# EAGLE design lpc1343-dip40 (EAGLE 5.09)
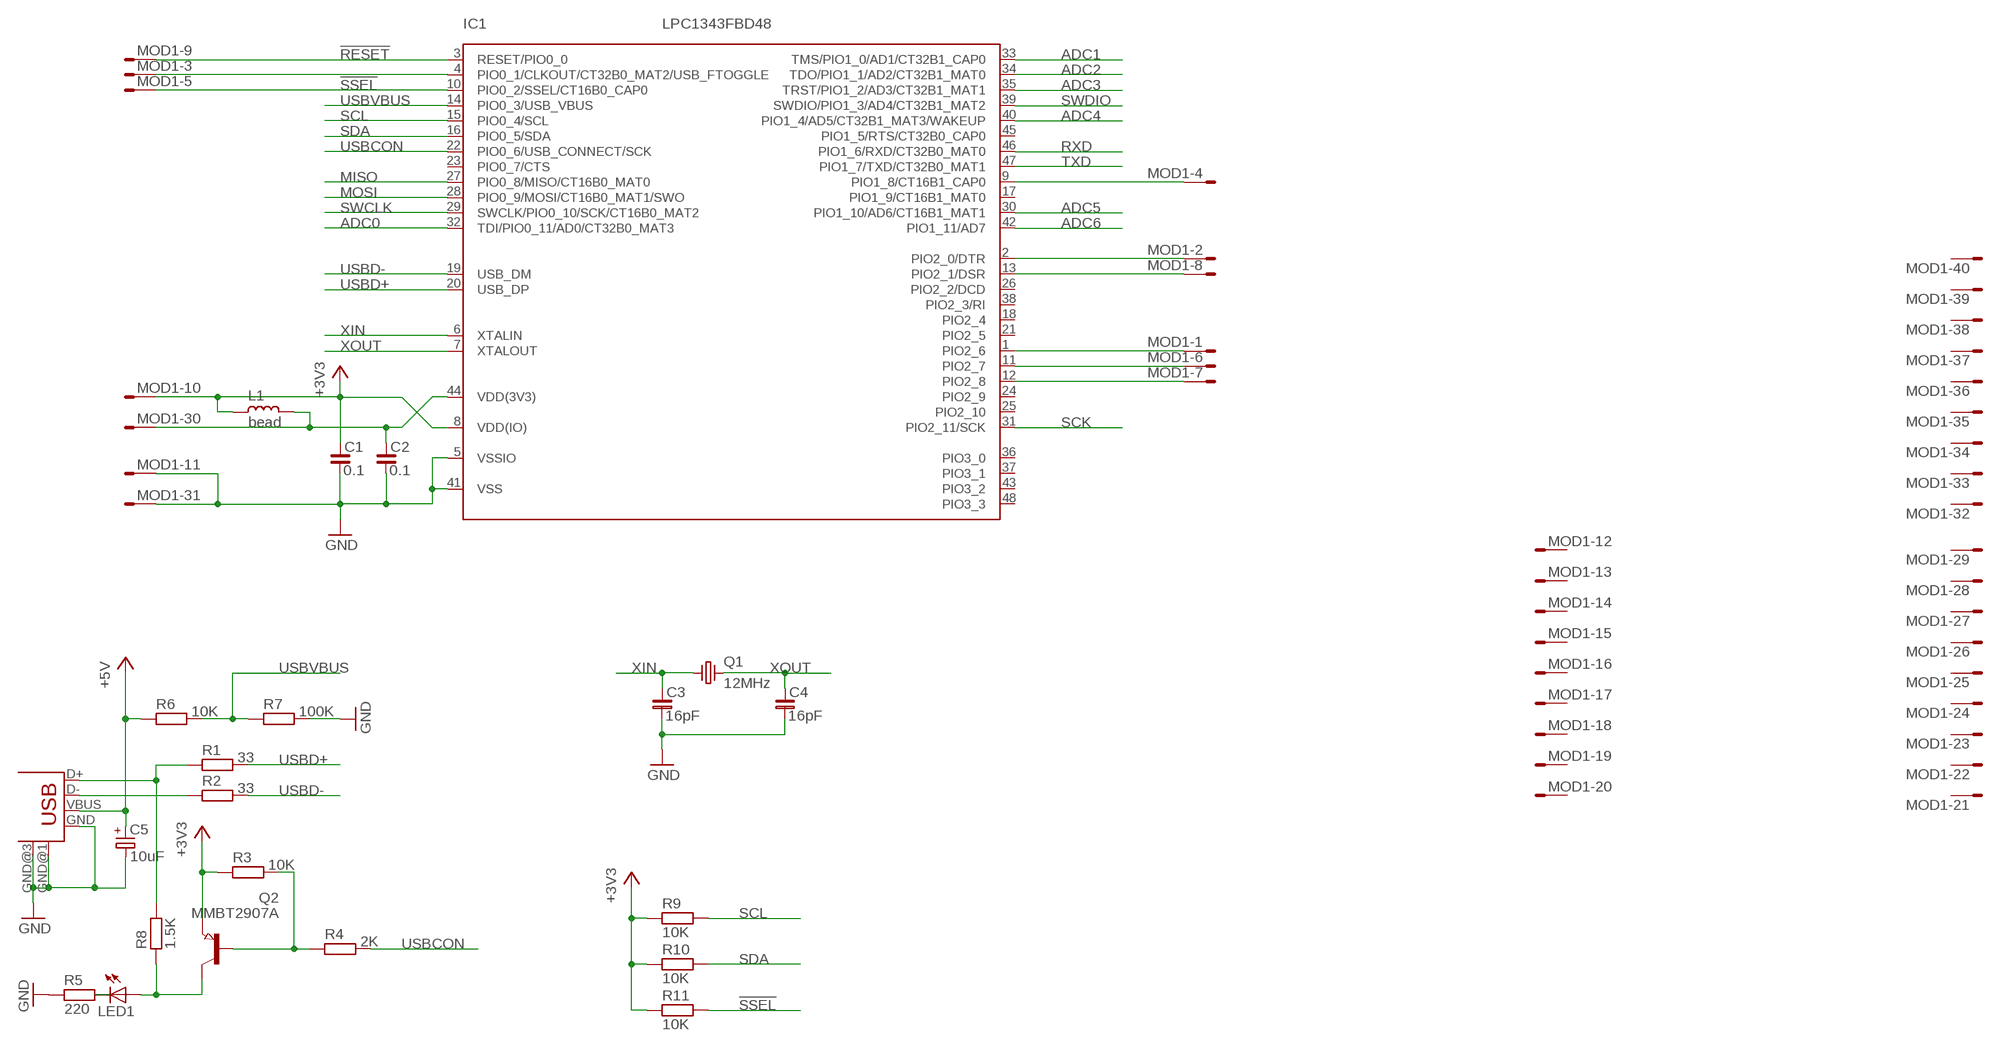
[diagram p0: schematic, sheet 1]

## Parts
C1  0.1  C_0603  [C0603]
C2  0.1  C_0603  [C0603]
C3  16pF  C_0603  [C0603]
C4  16pF  C_0603  [C0603]
C5  10uF  CP_SMCA  [SMC_A]
IC1  LPC1343FBD48  [LQFP48-7X7]
L1  bead  L_0603  [L0603]
LED1  LEDCHIP-LED0603  [CHIP-LED0603]
MOD1  40E  [40P]
Q1  12MHz  CRYSTAL-HC49S  [HC49/S]
Q2  MMBT2907A  PNP-TRANSISTOR_SOT23  [SOT23]
R1  33  R_0603  [R0603]
R2  33  R_0603  [R0603]
R3  10K  R_0603  [R0603]
R4  2K  R_0603  [R0603]
R5  220  R_0603  [R0603]
R6  10K  R_0603  [R0603]
R7  100K  R_0603  [R0603]
R8  1.5K  R_0603  [R0603]
R9  10K  R_0603  [R0603]
R10  10K  R_0603  [R0603]
R11  10K  R_0603  [R0603]
USB1  USB-MB-S  [USB-MB-S]

## Nets
!RESET: IC1.3(RESET/PIO0_0) MOD1.9
!SSEL: IC1.10(PIO0_2/SSEL/CT16B0_CAP0) MOD1.5 R11.2
+3V3: C1.1 IC1.8(VDD(IO)) L1.2 MOD1.10 Q2.2(E) R3.1 R9.1 R10.1 R11.1
+5V: C5.+ R6.1 USB1.VBUS
ADC0: IC1.32(TDI/PIO0_11/AD0/CT32B0_MAT3)
ADC1: IC1.33(TMS/PIO1_0/AD1/CT32B1_CAP0)
ADC2: IC1.34(TDO/PIO1_1/AD2/CT32B1_MAT0)
ADC3: IC1.35(TRST/PIO1_2/AD3/CT32B1_MAT1)
ADC4: IC1.40(PIO1_4/AD5/CT32B1_MAT3/WAKEUP)
ADC5: IC1.30(PIO1_10/AD6/CT16B1_MAT1)
ADC6: IC1.42(PIO1_11/AD7)
GND: C1.2 C2.2 C3.2 C4.2 C5.- IC1.5(VSSIO) IC1.41(VSS) MOD1.11 MOD1.31 R5.1 R7.2 USB1.GND USB1.GND@1(GND) USB1.GND@3(GND)
MISO: IC1.27(PIO0_8/MISO/CT16B0_MAT0)
MOSI: IC1.28(PIO0_9/MOSI/CT16B0_MAT1/SWO)
N$1: R2.1 USB1.D-
N$2: LED1.C R5.2
N$3: LED1.A Q2.3(C) R8.1
N$4: IC1.4(PIO0_1/CLKOUT/CT32B0_MAT2/USB_FTOGGLE) MOD1.3
N$5: Q2.1(B) R3.2 R4.1
N$6: IC1.2(PIO2_0/DTR) MOD1.2
N$7: R1.1 R8.2 USB1.D+
N$8: IC1.1(PIO2_6) MOD1.1
N$9: IC1.9(PIO1_8/CT16B1_CAP0) MOD1.4
N$10: IC1.13(PIO2_1/DSR) MOD1.8
N$11: IC1.11(PIO2_7) MOD1.6
N$12: IC1.12(PIO2_8) MOD1.7
N$20: C2.1 IC1.44(VDD(3V3)) L1.1 MOD1.30
RXD: IC1.46(PIO1_6/RXD/CT32B0_MAT0)
SCK: IC1.31(PIO2_11/SCK)
SCL: IC1.15(PIO0_4/SCL) R9.2
SDA: IC1.16(PIO0_5/SDA) R10.2
SWCLK: IC1.29(SWCLK/PIO0_10/SCK/CT16B0_MAT2)
SWDIO: IC1.39(SWDIO/PIO1_3/AD4/CT32B1_MAT2)
TXD: IC1.47(PIO1_7/TXD/CT32B0_MAT1)
USBCON: IC1.22(PIO0_6/USB_CONNECT/SCK) R4.2
USBD+: IC1.20(USB_DP) R1.2
USBD-: IC1.19(USB_DM) R2.2
USBVBUS: IC1.14(PIO0_3/USB_VBUS) R6.2 R7.1
XIN: C3.1 IC1.6(XTALIN) Q1.1
XOUT: C4.1 IC1.7(XTALOUT) Q1.2
Unconnected: IC1.17(PIO1_9/CT16B1_MAT0) IC1.18(PIO2_4) IC1.21(PIO2_5) IC1.23(PIO0_7/CTS) IC1.24(PIO2_9) IC1.25(PIO2_10) IC1.26(PIO2_2/DCD) IC1.36(PIO3_0) IC1.37(PIO3_1) IC1.38(PIO2_3/RI) IC1.43(PIO3_2) IC1.45(PIO1_5/RTS/CT32B0_CAP0) IC1.48(PIO3_3) MOD1.12 MOD1.13 MOD1.14 MOD1.15 MOD1.16 MOD1.17 MOD1.18 MOD1.19 MOD1.20 MOD1.21 MOD1.22 MOD1.23 MOD1.24 MOD1.25 MOD1.26 MOD1.27 MOD1.28 MOD1.29 MOD1.32 MOD1.33 MOD1.34 MOD1.35 MOD1.36 MOD1.37 MOD1.38 MOD1.39 MOD1.40

## Library data of the parts
C1-C4 = rc-master-smd:C_: NON-POLARIZED CAP
C5 = rc-master-smd:CP_: POLARIZED CAP
IC1 = lpc1xxx-v6:LPC1343FBD48: LPC1343 72 MHz 32-bit ARM Cortex-M3 based microcontroller featuring a high level of integration and low power consumption. 32 kB Flash, 8 kB SRAM, USB Device MarcVl - Datasheet available on www.nxp.com
L1 = rc-master-smd:L_: INDUCTOR
LED1 = led:LED: LED OSRAM: - CHIPLED LG R971, LG N971, LY N971, LG Q971, LY Q971, LO R971, LY R971 LH N974, LH R974 LS Q976, LO Q976, LY Q976 LO Q996 - Hyper CHIPLED LW Q18S LB Q993, LB Q99A, LB R99A - SideLED LS A670, LO A670, LY A670, LG A670, LP A670 LB A673, LV A673, LT A673, LW A673 LH A674 LY A675 LS A676, LA A676, LO A676, LY A676, LW A676 LS A679, LY A679, LG A679 - Hyper Micro SIDELED® LS Y876, LA Y876, LO Y876, LY Y876 LT Y87S - SmartLED LW L88C, LW L88S LB L89C, LB L89S, LG L890 LS L89K, LO L89K, LY L89K LS L896, LA L896, LO L896, LY L896 - TOPLED LS T670, LO T670, LY T670, LG T670, LP T670 LSG T670, LSP T670, LSY T670, LOP T670, LYG T670 LG T671, LOG T671, LSG T671 LB T673, LV T673, LT T673, LW T673 LH T674 LS T676, LA T676, LO T676, LY T676, LB T676, LH T676, LSB T676, LW T676 LB T67C, LV T67C, LT T67C, LS T67K, LO T67K, LY T67K, LW E67C LS E67B, LA E67B, LO E67B, LY E67B, LB E67C, LV E67C, LT E67C LW T67C LS T679, LY T679, LG T679 LS T770, LO T770, LY T770, LG T770, LP T770 LB T773, LV T773, LT T773, LW T773 LH T774 LS E675, LA E675, LY E675, LS T675 LS T776, LA T776, LO T776, LY T776, LB T776 LHGB T686 LT T68C, LB T68C - Hyper Mini TOPLED® LB M676 - Mini TOPLED Santana® LG M470 LS M47K, LO M47K, LY M47K Source: http://www.osram.convergy.de - LUMILED® LXK2-PW12-R00, LXK2-PW12-S00, LXK2-PW14-U00, LXK2-PW14-V00 LXK2-PM12-R00, LXK2-PM12-S00, LXK2-PM14-U00 LXK2-PE12-Q00, LXK2-PE12-R00, LXK2-PE12-S00, LXK2-PE14-T00, LXK2-PE14-U00 LXK2-PB12-K00, LXK2-PB12-L00, LXK2-PB12-M00, LXK2-PB14-N00, LXK2-PB14-P00, LXK2-PB14-Q00 LXK2-PR12-L00, LXK2-PR12-M00, LXK2-PR14-Q00, LXK2-PR14-R00 LXK2-PD12-Q00, LXK2-PD12-R00, LXK2-PD12-S00 LXK2-PH12-R00, LXK2-PH12-S00 LXK2-PL12-P00, LXK2-PL12-Q00, LXK2-PL12-R00 Source: www.luxeon.com
MOD1 = misc:40E: DIL CABLE CONNECTOR
Q1 = crystal:CRYSTAL-: CRYSTAL
Q2 = semicon-smd-ipc:PNP-TRANSISTOR_: PNP TRANSISTOR
R1-R11 = rc-master-smd:R_: RESISTOR
USB1 = usb:USB: USB Connectors

## Board
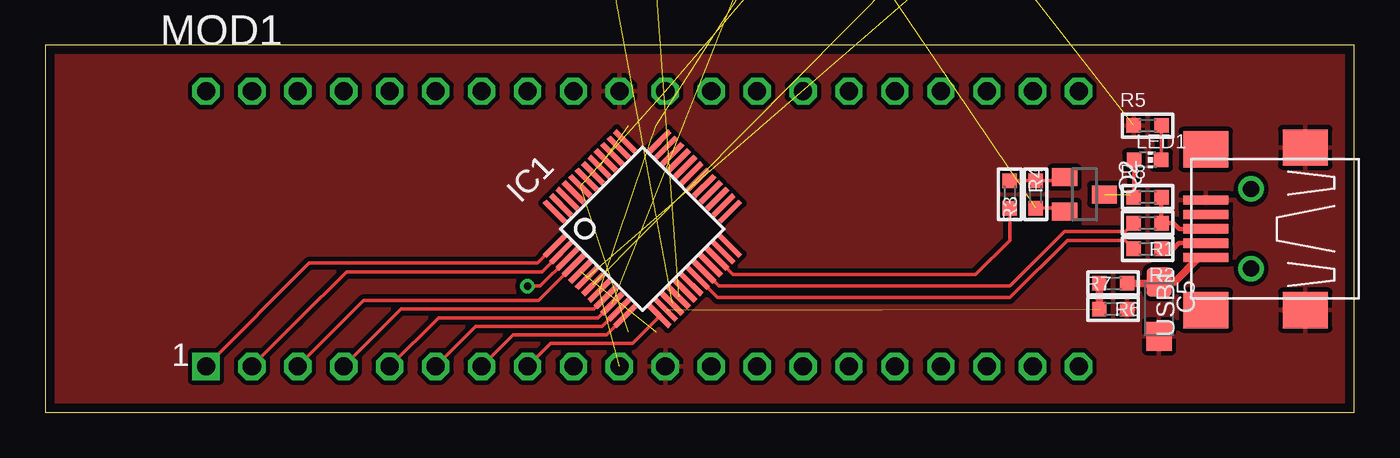
[diagram p1: board, top side]
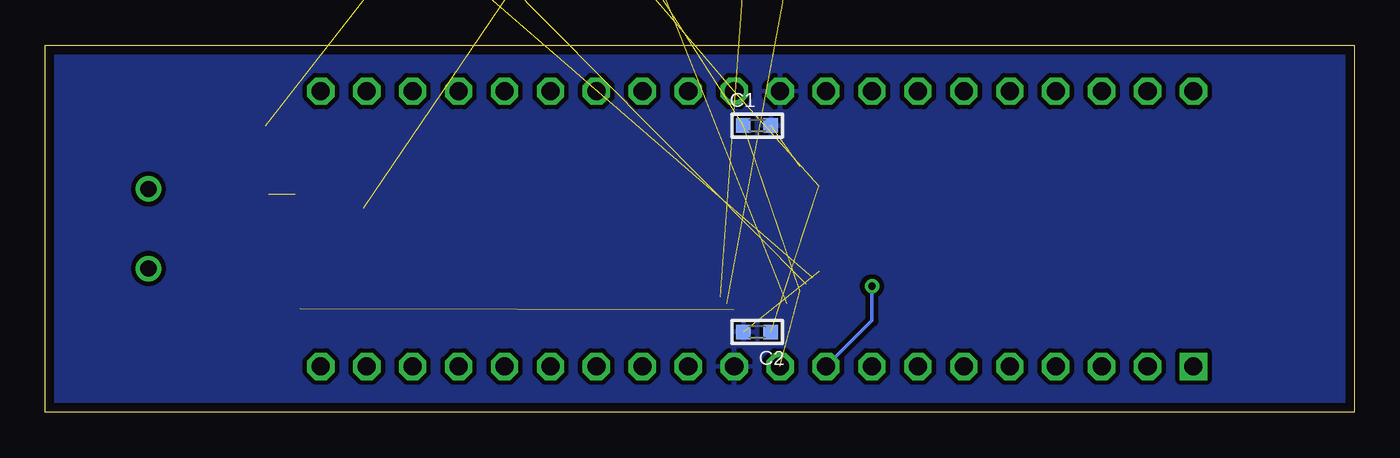
[diagram p2: board, bottom side, seen from below]

Size 72.39 x 20.32 mm. Coordinates in mm from the lower left corner, seen from the top.
Outline: 72.39,20.32 0,20.32 0,0 72.39,0 72.39,20.32
Copper layers (1*16): Top 0.018mm / dielectric 1.5mm / Bottom 0.018mm
Design rules "default *": minimum track width 0.15mm, minimum drill 0.4mm, track to track 0.15mm, track to pad 0.15mm, pad to pad 0.15mm, via to via 0.15mm, smd to smd 0.15mm, copper to edge 0.5mm, drill to drill 8mil, minimum pad ring 10mil, minimum via ring 8mil, stop-mask expansion 4mil, vias tented up to drill 0mil, thermal gap 10mil

### Footprints (pad centres in the part's own frame; a part is rotated, then mirrored left to right if it is on the bottom)
C0603 = smd 0.8 x 0.8: 1 -0.762,0; 2 0.762,0
SMC_A = smd 1.6 x 1.4: + -1.5,0; - 1.5,0
LQFP48-7X7 = smd 0.3 x 1.6: 1 -2.75,-4.1; 2 -2.25,-4.1; 3 -1.75,-4.1; 4 -1.25,-4.1; 5 -0.75,-4.1; 6 -0.25,-4.1; 7 0.25,-4.1; 8 0.75,-4.1; 9 1.25,-4.1; 10 1.75,-4.1; 11 2.25,-4.1; 12 2.75,-4.1; 25 2.75,4.1; 26 2.25,4.1; 27 1.75,4.1; 28 1.25,4.1; 29 0.75,4.1; 30 0.25,4.1; 31 -0.25,4.1; 32 -0.75,4.1; 33 -1.25,4.1; 34 -1.75,4.1; 35 -2.25,4.1; 36 -2.75,4.1 | smd 1.6 x 0.3: 13 4.1,-2.75; 14 4.1,-2.25; 15 4.1,-1.75; 16 4.1,-1.25; 17 4.1,-0.75; 18 4.1,-0.25; 19 4.1,0.25; 20 4.1,0.75; 21 4.1,1.25; 22 4.1,1.75; 23 4.1,2.25; 24 4.1,2.75; 37 -4.1,2.75; 38 -4.1,2.25; 39 -4.1,1.75; 40 -4.1,1.25; 41 -4.1,0.75; 42 -4.1,0.25; 43 -4.1,-0.25; 44 -4.1,-0.75; 45 -4.1,-1.25; 46 -4.1,-1.75; 47 -4.1,-2.25; 48 -4.1,-2.75
L0603 = smd 0.8 x 0.8: 1 -0.762,0; 2 0.762,0
CHIP-LED0603 = smd 0.8 x 0.8: A 0,-0.75; C 0,0.75
40P = drill 1 square: 1 -24.13,-7.62 | drill 1 octagon: 2 -21.59,-7.62; 3 -19.05,-7.62; 4 -16.51,-7.62; 5 -13.97,-7.62; 6 -11.43,-7.62; 7 -8.89,-7.62; 8 -6.35,-7.62; 9 -3.81,-7.62; 10 -1.27,-7.62; 11 1.27,-7.62; 12 3.81,-7.62; 13 6.35,-7.62; 14 8.89,-7.62; 15 11.43,-7.62; 16 13.97,-7.62; 17 16.51,-7.62; 18 19.05,-7.62; 19 21.59,-7.62; 20 24.13,-7.62; 21 24.13,7.62; 22 21.59,7.62; 23 19.05,7.62; 24 16.51,7.62; 25 13.97,7.62; 26 11.43,7.62; 27 8.89,7.62; 28 6.35,7.62; 29 3.81,7.62; 30 1.27,7.62; 31 -1.27,7.62; 32 -3.81,7.62; 33 -6.35,7.62; 34 -8.89,7.62; 35 -11.43,7.62; 36 -13.97,7.62; 37 -16.51,7.62; 38 -19.05,7.62; 39 -21.59,7.62; 40 -24.13,7.62
HC49/S = drill 0.8 round: 1 -2.413,0; 2 2.413,0
SOT23 = smd 1 x 1.4: 1 -0.95,-1.1; 2 0.95,-1.1; 3 0,1.1
R0603 = smd 0.8 x 0.8: 1 -0.762,0; 2 0.762,0
USB-MB-S = smd 2.5 x 0.5: D+ 2.5,0; D- 2.5,0.8; GND 2.5,-1.6; ID 2.5,-0.8; VBUS 2.5,1.6 | smd 2.5 x 2: GND@1 -3,4.5; GND@2 2.5,4.5; GND@3 -3,-4.5; GND@4 2.5,-4.4 | drill 0.9 round: P$5 0,2.2; P$6 0,-2.2

### Placement (x,y rotation side)
C1  33.02,15.88 0 bottom
C2  33.02,4.45 180 bottom
C3  52.07,27.3 180 top  (outside the outline)
C4  52.07,29.84 180 top  (outside the outline)
C5  61.59,5.71 270 top
IC1  33.02,10.16 315 top
L1  43.18,27.3 0 top  (outside the outline)
LED1  60.96,13.97 270 top
MOD1  33.02,10.16 0 top
Q1  59.69,28.57 0 top  (outside the outline)
Q2  57.47,12.06 270 top
R1  60.96,10.48 180 top
R2  60.96,9.05 180 top
R3  54.77,12.06 90 top
R4  53.34,12.06 270 top
R5  60.96,15.88 0 top
R6  59.05,7.14 180 top
R7  59.05,5.71 0 top
R8  60.96,11.91 0 top
R9  31.11,26.04 270 top  (outside the outline)
R10  33.66,26.04 270 top  (outside the outline)
R11  39.37,25.4 90 top  (outside the outline)
USB1  66.67,10.16 180 top

### Tracks (layer width: path | path; a pad name or v marks a point on that pad's centre or on a via)
!RESET  (via drill 0.4)
  Top 0.203: IC1.3 27.37,6.99 v26.67,6.99
  Bottom 0.203: v26.67,6.99 26.67,5.08 MOD1.9
!SSEL  (1 unrouted)
  Top 0.203: IC1.10 30.57,5.24 21.75,5.24 MOD1.5
+3V3  (7 unrouted)
  Top 0.203: R3.1 56.18,11.3 Q2.2
+5V
  Top 0.406: USB1.VBUS 63.8,8.56 62.46,7.21 C5.+ 61.52,7.14 R6.1
GND  (4 unrouted)
  pour Top (isolate 0.254): 73.03,-0.64 -0.64,-0.64 -0.64,20.95 73.03,20.95
  pour Bottom (isolate 0.254): 73.03,-0.64 -0.64,-0.64 -0.64,20.95 73.03,20.95
N$1
  Top 0.254: USB1.D- 62.7,9.36 62.39,9.05 R2.1
N$2
  Top 0.203: LED1.C 61.71,15.86 R5.2
N$3  (1 unrouted)
  Top 0.203: LED1.A R8.1 60.04,12.06
N$4
  Top 0.203: IC1.4 27.28,6.19 17.62,6.19 MOD1.3
N$5
  Top 0.203: R4.1 R3.2 56.18,12.83 Q2.1
N$6
  Top 0.203: IC1.2 27.46,7.78 16.67,7.78 13.97,5.08 MOD1.2
N$7
  Top 0.254: USB1.D+ 62.71,10.16 62.39,10.48 R1.1 R8.2
N$8
  Top 0.203: IC1.1 27.23,8.26 14.61,8.26 MOD1.1
N$9
  Top 0.203: IC1.9 30.34,5.71 19.68,5.71 MOD1.4
N$10
  Top 0.203: IC1.13 32.47,3.81 27.94,3.81 MOD1.8
N$11
  Top 0.203: IC1.11 30.8,4.76 23.81,4.76 MOD1.6
N$12
  Top 0.203: IC1.12 31.04,4.29 25.88,4.29 MOD1.7
N$20  (3 unrouted)
SCL  (1 unrouted)
SDA  (1 unrouted)
USBCON
  Top 0.203: R4.2 53.34,9.53 51.44,7.62 38.03,7.62 IC1.22
USBD+
  Top 0.203: R1.2 59.72,10 56.36,10 53.34,6.99 37.26,6.99 IC1.20
USBD-
  Top 0.203: R2.2 59.72,9.53 56.52,9.53 53.34,6.35 37.18,6.35 IC1.19
USBVBUS  (1 unrouted)
  Top 0.406: R6.2 R7.1
XIN  (2 unrouted)
XOUT  (2 unrouted)